# Altium schematic sheet ATmega328P.SchDoc
size 292 x 193 mm; Author: Power Lin; SheetNumber: 1; SheetTotal: 1; Website: wiki-power.com
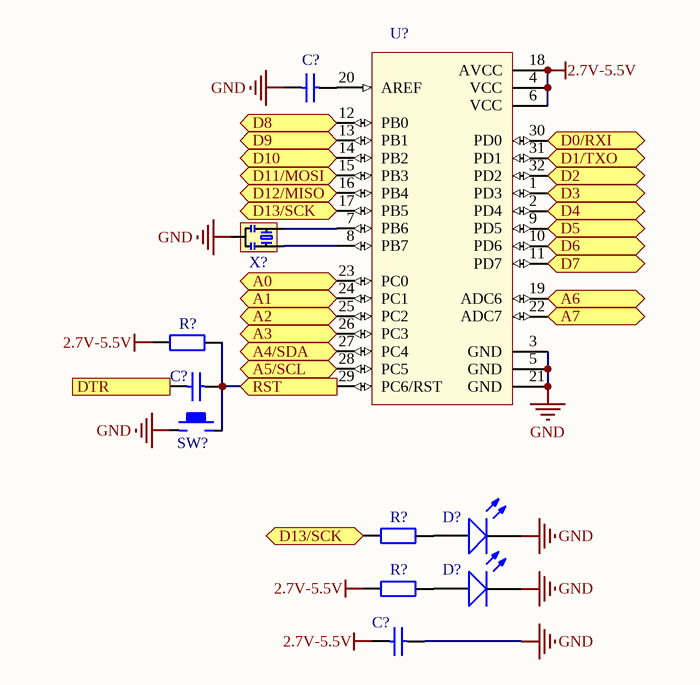
[diagram p0: ATmega328P.SchDoc]

## Parts
(Parts that share a designator on the sheet are numbered #1, #2 ... from top to bottom, then left to right.)
C?#1  100nF  [CAP-0603]  (value not drawn)
C?#2  100nF  [CAP-0603]  (value not drawn)
C?#3  100nF (104) 10% 50V  [0603_C]  (value not drawn)
D?#1  GREEN  [LED-0603]  (value not drawn)
D?#2  RED  [LED-0603]  (value not drawn)
R?#1  10KΩ  [R-0603]  (value not drawn)
R?#2  330Ω  [R-0603]  (value not drawn)
R?#3  10KΩ  [R-0603]  (value not drawn)
SW?  KEY  [KEY-4P-4.2*3.4*2.5]  (value not drawn)
U?  ATMEGA328P-AU  [*QFP80P900X900X120-32N]  (value not drawn)
X?  16MHz  [CSTCE_G(A)村田晶振]  (value not drawn)

## Ports
A0 (bidir), A1 (bidir), A2 (bidir), A3 (bidir), A4/SDA (bidir), A5/SCL (bidir), A6 (bidir), A7 (bidir), D0/RXI (bidir), D1/TXO (bidir), D2 (bidir), D3 (bidir), D4 (bidir), D5 (bidir), D6 (bidir), D7 (bidir), D8 (bidir), D9 (bidir), D10 (bidir), D11/MOSI (bidir), D12/MISO (bidir), D13/SCK (bidir), DTR (in), RST (in)

## Nets
2.7V-5.5V: C?#3.1 R?#1.1 R?#3.1 U?.4(VCC) U?.6(VCC) U?.18(AVCC)
GND: C?#1.1 C?#3.2 D?#1.K D?#2.K SW?.1 U?.3(GND) U?.5(GND) U?.21(GND) X?.2(GND)
A0: U?.23(PC0) ; port A0
A1: U?.24(PC1) ; port A1
A2: U?.25(PC2) ; port A2
A3: U?.26(PC3) ; port A3
A4/SDA: U?.27(PC4) ; port A4/SDA
A5/SCL: U?.28(PC5) ; port A5/SCL
A6: U?.19(ADC6) ; port A6
A7: U?.22(ADC7) ; port A7
D0/RXI: U?.30(PD0) ; port D0/RXI
D1/TXO: U?.31(PD1) ; port D1/TXO
D2: U?.32(PD2) ; port D2
D3: U?.1(PD3) ; port D3
D4: U?.2(PD4) ; port D4
D5: U?.9(PD5) ; port D5
D6: U?.10(PD6) ; port D6
D7: U?.11(PD7) ; port D7
D8: U?.12(PB0) ; port D8
D9: U?.13(PB1) ; port D9
D10: U?.14(PB2) ; port D10
D11/MOSI: U?.15(PB3) ; port D11/MOSI
D12/MISO: U?.16(PB4) ; port D12/MISO
D13/SCK: R?#2.1 U?.17(PB5) ; port D13/SCK
DTR: C?#2.1 ; port DTR
RST: C?#2.2 R?#1.2 SW?.2 U?.29(PC6/RST) ; port RST
NetC?#1_2: C?#1.2 U?.20(AREF)
NetD?#1_A: D?#1.A R?#2.2
NetD?#2_A: D?#2.A R?#3.2
NetU?_7: U?.7(PB6) X?.1(OSC1)
NetU?_8: U?.8(PB7) X?.3(OSC2)

## Notes on the sheet
- Author
- DocumentName
- ModifiedDate
- ProjectName
- SheetNumber
- SheetTotal
- Website
- Revision

## Library data of the parts
C?#1 C?#2 = CAP: 贴片电容; ComponentLink1Description: 供应商链接; ComponentLink1URL: http://www.szlcsc.com/product/details_53938.html; Package: 0402; Supplier: LC; SuppliersPartNumber: C52923
C?#3 = 0603 100nF (104) 10% 50V: 贴片电容; ComponentLink1Description: 供应商链接; ComponentLink1URL: http://www.szlcsc.com/product/details_15331.html; Package: 0603; Supplier: LC; SuppliersPartNumber: C14663
D?#1 D?#2 = LED: 发光二极管; ComponentLink1Description: 供应商链接; ComponentLink1URL: http://www.szlcsc.com/product/details_2663.html; Package: 0603; Supplier: LC; SuppliersPartNumber: C2290
R?#1-R?#3 = RES: 贴片电阻; Package: 0805; Supplier: LC; SuppliersPartNumber: C17798
SW? = KEY: 按键开关
U? = ATMEGA328P-AU: 微控制器, 8 Bit, Atmega, 20mhz, Tqfp-32; MF: Microchip; SnapEDA_Link: https://www.snapeda.com/parts/ATMEGA328P-AU/Microchip/view-part/?ref=snap; Availability: Unavailable; Price: None; MP: ATMEGA328P-AU; Package: TQFP-32 Microchip; Value: *
X? = XTAL: 有源晶振